# EAGLE schematic AD8403_SVF_Level (EAGLE 7.2.0)
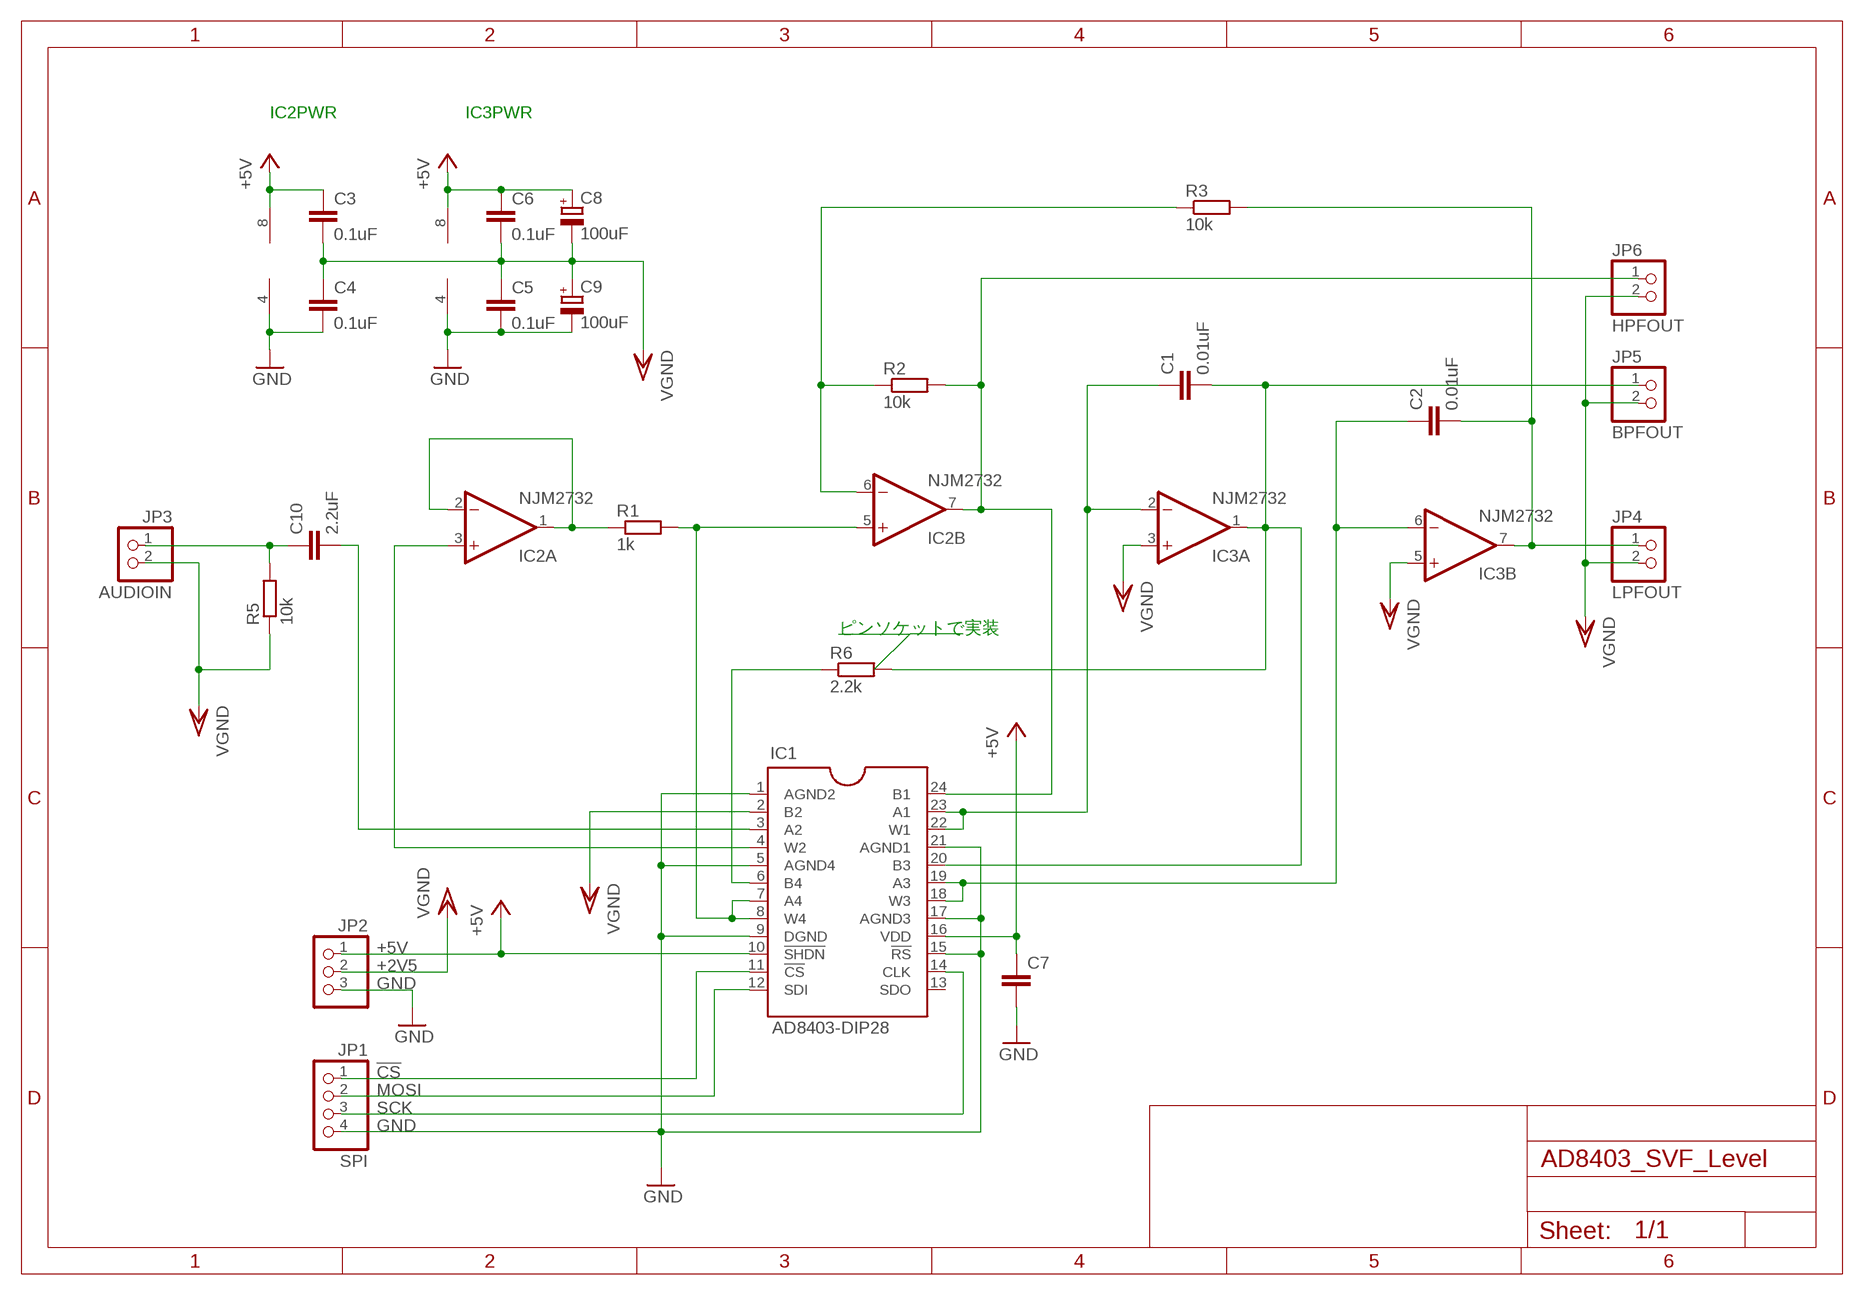
[diagram p0: schematic, sheet 1]

## Parts
C1  0.01uF  C-EU025-025X050  [C025-025X050]
C2  0.01uF  C-EU025-025X050  [C025-025X050]
C3  0.1uF  C-EU025-024X044  [C025-024X044]
C4  0.1uF  C-EU025-024X044  [C025-024X044]
C5  0.1uF  C-EU025-024X044  [C025-024X044]
C6  0.1uF  C-EU025-024X044  [C025-024X044]
C7  C-EU025-024X044  [C025-024X044]
C8  100uF  CPOL-EUE2.5-7  [E2,5-7]
C9  100uF  CPOL-EUE2.5-7  [E2,5-7]
C10  2.2uF  C-EU050-055X075  [C050-055X075]
IC1  AD8403-DIP28  [AD8403-DIP28]
IC2  NJM2732  LM4558N  [DIL08]
IC3  NJM2732  LM4558N  [DIL08]
JP1  SPI  PINHD-1X4  [1X04]
JP2  PINHD-1X3  [1X03]
JP3  AUDIOIN  PINHD-1X2  [1X02]
JP4  LPFOUT  PINHD-1X2  [1X02]
JP5  BPFOUT  PINHD-1X2  [1X02]
JP6  HPFOUT  PINHD-1X2  [1X02]
R1  1k  R-EU_0207/7  [0207/7]
R2  10k  R-EU_0207/7  [0207/7]
R3  10k  R-EU_0207/7  [0207/7]
R5  10k  R-EU_0207/7  [0207/7]
R6  2.2k  R-EU_0207/7  [0207/7]

## Nets
!CS: IC1.11(!CS) JP1.1
+2V5: JP2.2 ; supply symbol labelled VGND
+5V: C3.1 C6.1 C7.1 C8.+ IC1.10(!SHDN) IC1.16(VDD) IC2.8(P:V+) IC3.8(P:V+) JP2.1
GND: C4.2 C5.2 C7.2 C9.- IC1.1(AGND2) IC1.5(AGND4) IC1.9(DGND) IC1.15(!RS) IC1.17(AGND3) IC1.21(AGND1) IC2.4(P:V-) IC3.4(P:V-) JP1.4 JP2.3
MOSI: IC1.12(SDI) JP1.2
N$1: C10.1 JP3.1 R5.2
N$2: IC1.4(W2) IC2.3(A:+IN)
N$3: IC2.1(A:OUT) IC2.2(A:-IN) R1.1
N$4: IC2.6(B:-IN) R2.1 R3.1
N$5: IC1.24(B1) IC2.7(B:OUT) JP6.1 R2.2
N$6: C2.1 IC1.18(W3) IC1.19(A3) IC3.6(B:-IN)
N$7: C1.1 IC1.22(W1) IC1.23(A1) IC3.2(A:-IN)
N$8: C10.2 IC1.3(A2)
N$9: C2.2 IC3.7(B:OUT) JP4.1 R3.2
N$10: C1.2 IC1.20(B3) IC3.1(A:OUT) JP5.1 R6.2
N$12: IC1.6(B4) R6.1
N$14: IC1.7(A4) IC1.8(W4) IC2.5(B:+IN) R1.2
SCK: IC1.14(CLK) JP1.3
VCC/2: C3.2 C4.1 C5.1 C6.2 C8.- C9.+ IC1.2(B2) IC3.3(A:+IN) IC3.5(B:+IN) JP3.2 JP4.2 JP5.2 JP6.2 R5.1 ; supply symbol labelled VGND
Unconnected: IC1.13(SDO)

## Notes on the sheet
- IC2PWR | IC3PWR
- ピンソケットで実装

## Library data of the parts
C1-C7 C10 = rcl:C-EU: CAPACITOR, European symbol
C8 C9 = rcl:CPOL-EU: POLARIZED CAPACITOR, European symbol
IC1 = mylib2:AD8403-DIP28: AD8403 with 28PIN DIP化基板
IC2 IC3 = linear:*4558: OP AMP
JP1 = pinhead:PINHD-1X4: PIN HEADER
JP2 = pinhead:PINHD-1X3: PIN HEADER
JP3-JP6 = pinhead:PINHD-1X2: PIN HEADER
R1-R3 R5 R6 = rcl:R-EU_: RESISTOR, European symbol